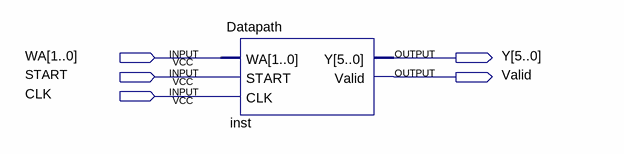
[diagram p0: schematic sheet]
// Quartus schematic Tong1_9.bdf as structural Verilog: 1 symbols, 5 pins
module Tong1_9 (
  input  [1:0] WA,
  input  START,
  input  CLK,
  output [5:0] Y,
  output Valid
);

  Datapath inst (.WA(WA), .START(START), .CLK(CLK), .Y(Y), .Valid(Valid));
endmodule
